# EAGLE design M220A (EAGLE 6.6.0)
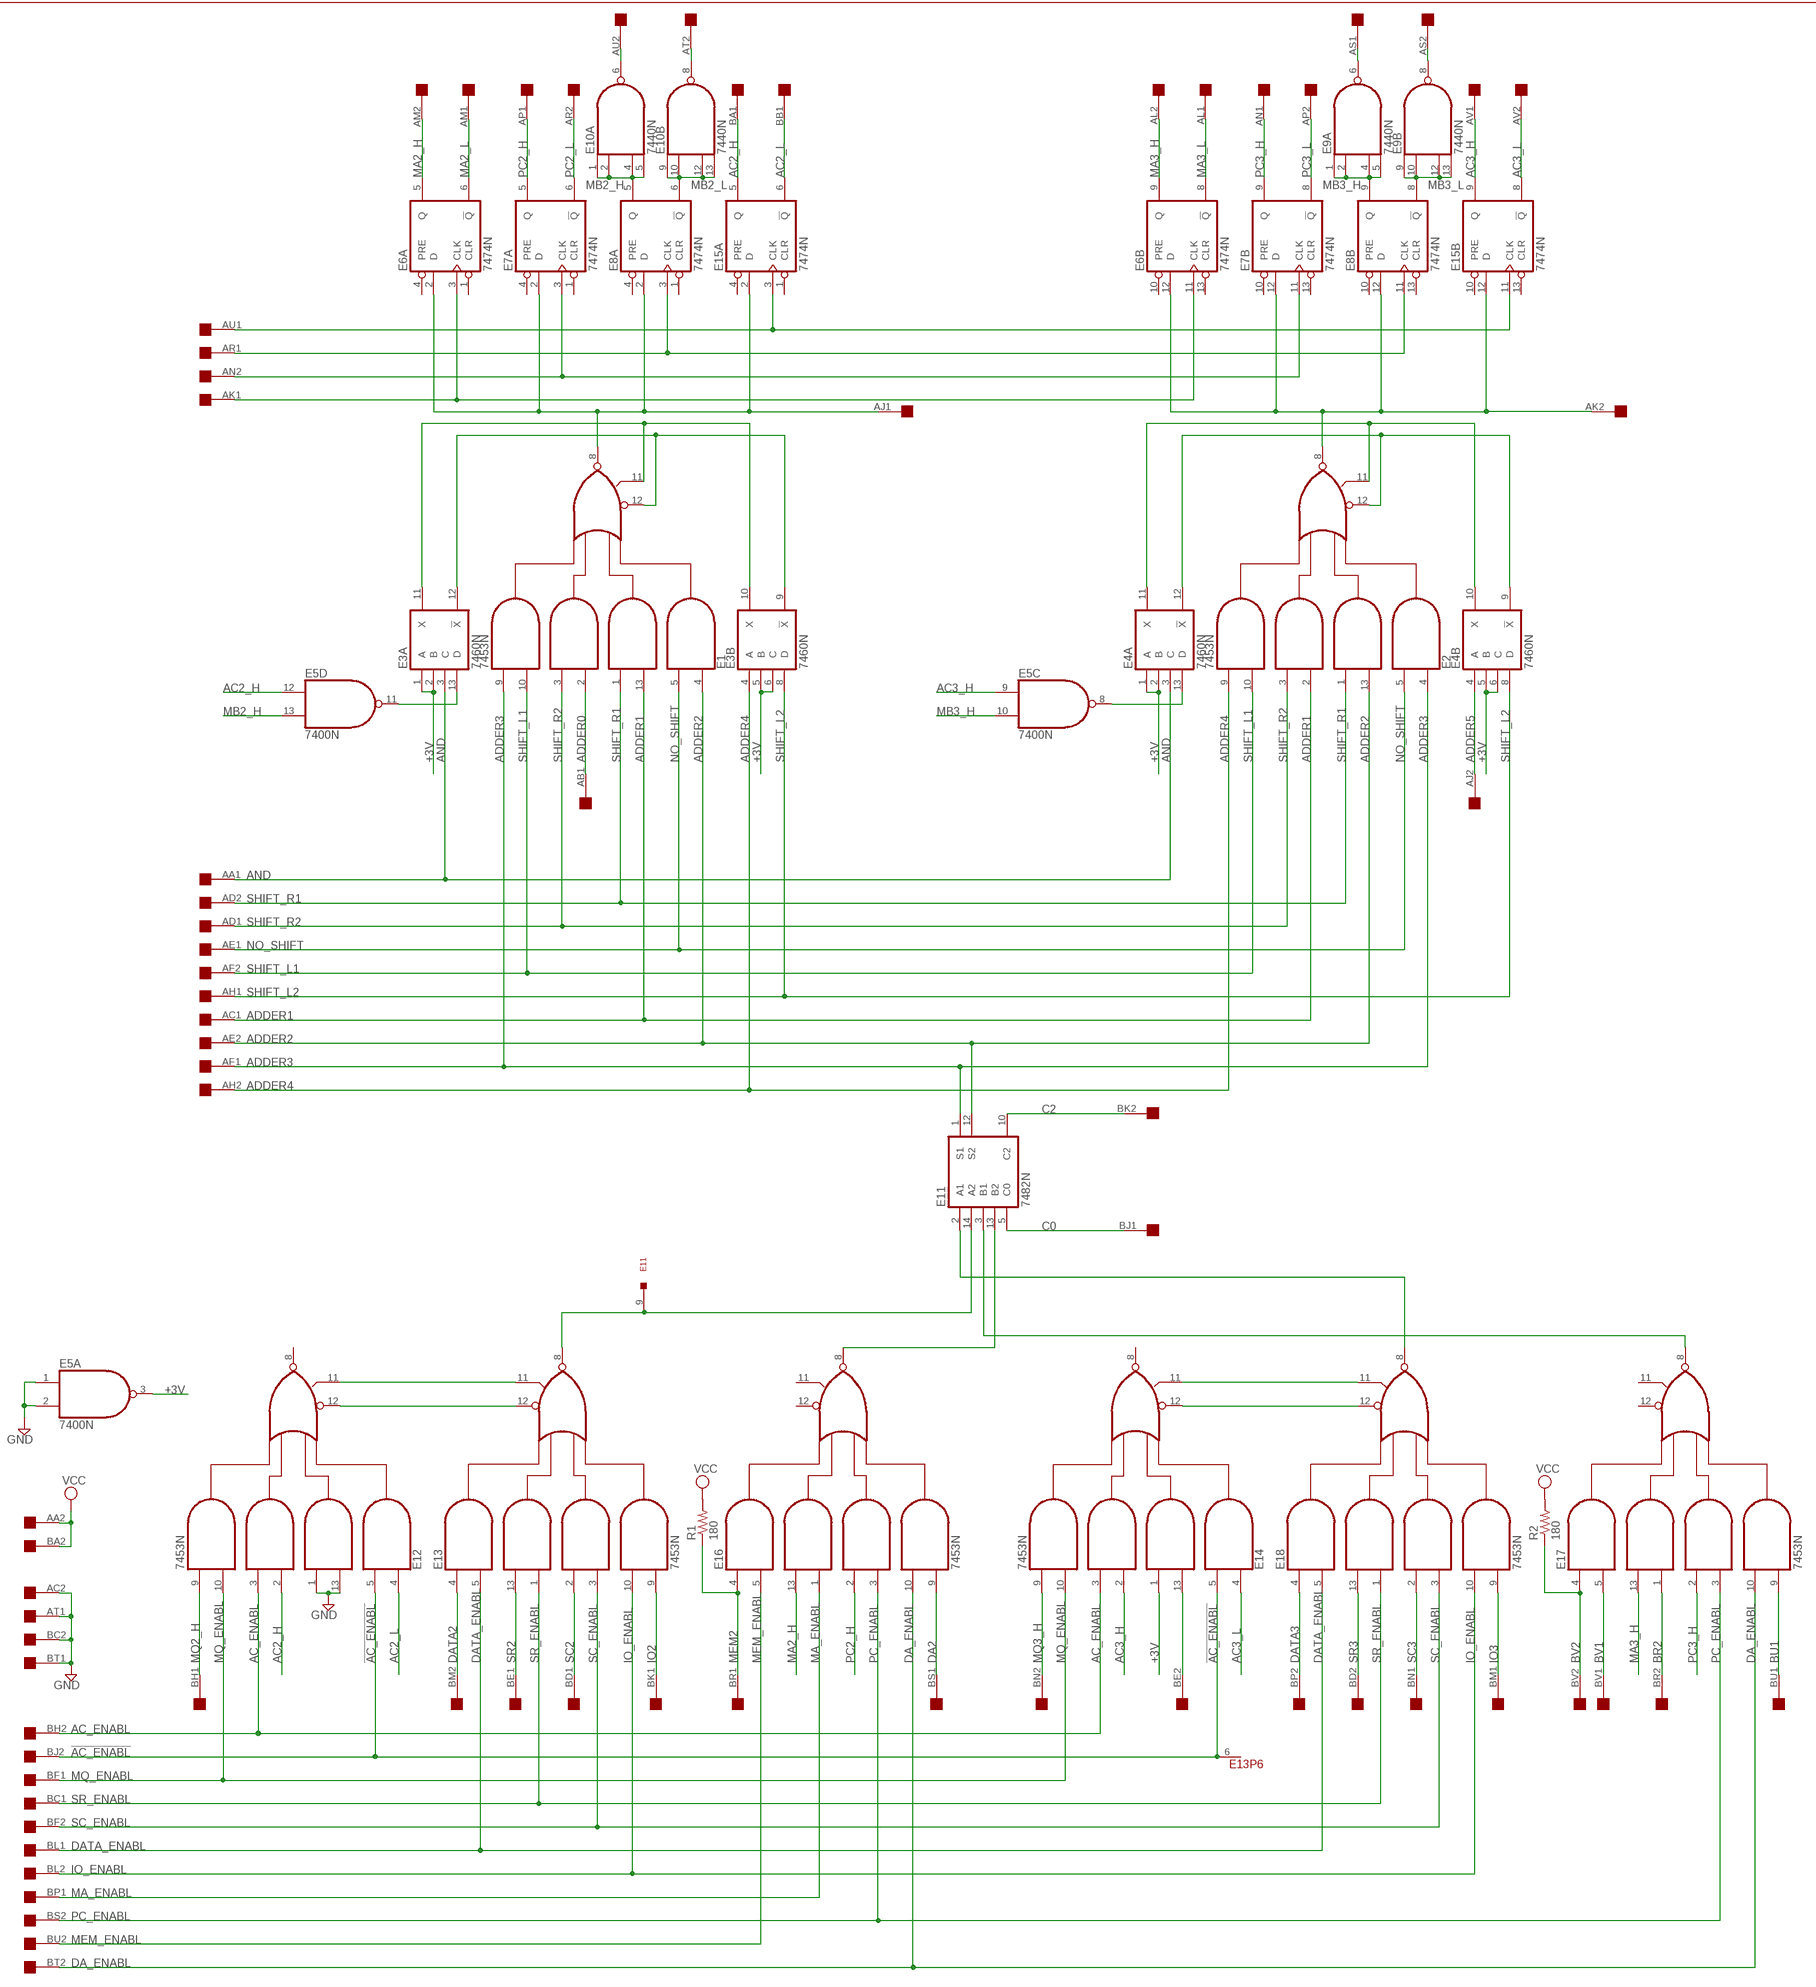
[diagram p0: schematic, sheet 1, part 1 of 2]
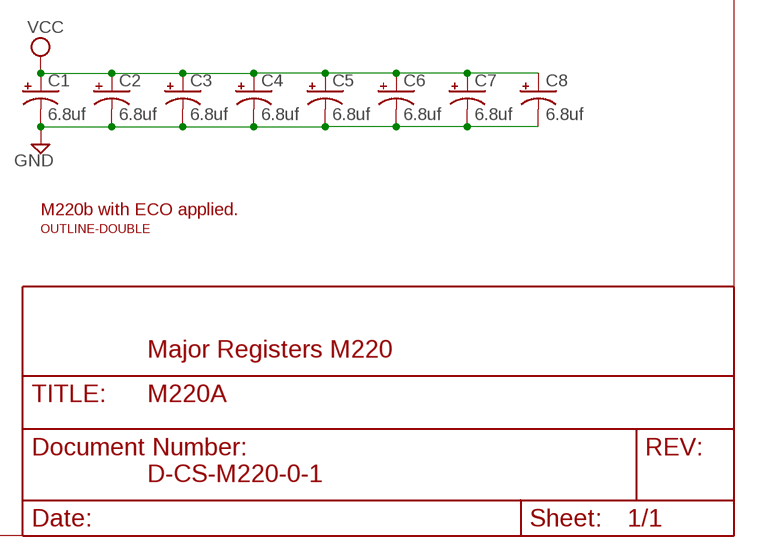
[diagram p1: schematic, sheet 1, part 2 of 2]

## Parts
C1  6.8uf  CPOL-USE15-5AXIAL  [E15-5]
C2  6.8uf  CPOL-USE15-5AXIAL  [E15-5]
C3  6.8uf  CPOL-USE15-5AXIAL  [E15-5]
C4  6.8uf  CPOL-USE15-5AXIAL  [E15-5]
C5  6.8uf  CPOL-USE15-5AXIAL  [E15-5]
C6  6.8uf  CPOL-USE15-5AXIAL  [E15-5]
C7  6.8uf  CPOL-USE15-5AXIAL  [E15-5]
C8  6.8uf  CPOL-USE15-5AXIAL  [E15-5]
E1  7453N  [DIL14]
E2  7453N  [DIL14]
E3  7460N  [DIL14]
E4  7460N  [DIL14]
E5  7400N  [DIL14]
E6  7474N  74S74N  [DIL14]
E7  7474N  74S74N  [DIL14]
E8  7474N  74S74N  [DIL14]
E9  7440N  74S20N  [DIL14]
E10  7440N  74S20N  [DIL14]
E11  7482N  [DIL14]
E12  7453N  [DIL14]
E13  7453N  [DIL14]
E14  7453N  [DIL14]
E15  7474N  74S74N  [DIL14]
E16  7453N  [DIL14]
E17  7453N  [DIL14]
E18  7453N  [DIL14]
R1  180  R-US_0207/10  [0207/10]
R2  180  R-US_0207/10  [0207/10]
U$1  DOUBLE  [EDGE-CON4]
U$2  OUTLINE-DOUBLE  [DOUBLE]

## Nets
!AC_ENABL: E12.5(I2) E13.6(SPARE) E14.5(I2) U$1.BJ2
+3V: E3.1(A:A) E3.2(A:B) E3.5(B:B) E3.6(B:C) E4.1(A:A) E4.2(A:B) E4.5(B:B) E4.6(B:C) E5.3(A:O) E14.1(I4)
AC2_H: E5.12(D:I0) E12.2(I5) E15.5(A:Q) U$1.BA1
AC2_L: E12.4(I1) E15.6(A:!Q) U$1.BB1
AC3_H: E5.9(C:I0) E14.2(I5) E15.9(B:Q) U$1.AV1
AC3_L: E14.4(I1) E15.8(B:!Q) U$1.AV2
AC_ENABL: E12.3(I6) E14.3(I6) U$1.BH2
ADDER0: E1.2(I5) U$1.AB1
ADDER1: E1.13(I3) E2.2(I5) U$1.AC1
ADDER2: E1.4(I1) E2.13(I3) E11.12(S2) U$1.AE2
ADDER3: E1.9(I8) E2.4(I1) E11.1(S1) U$1.AF1
ADDER4: E2.9(I8) E3.4(B:A) U$1.AH2
ADDER5: E4.4(B:A) U$1.AJ2
AJ1: E1.8(O) E6.2(A:D) E7.2(A:D) E8.2(A:D) E15.2(A:D) U$1.AJ1
AK1: E6.3(A:CLK) E6.11(B:CLK) U$1.AK1
AK2: E2.8(O) E6.12(B:D) E7.12(B:D) E8.12(B:D) E15.12(B:D) U$1.AK2
AN2: E7.3(A:CLK) E7.11(B:CLK) U$1.AN2
AND: E3.3(A:C) E4.3(A:C) U$1.AA1
AR1: E8.3(A:CLK) E8.11(B:CLK) U$1.AR1
AS2: E9.8(B:O) U$1.AS2
AT2: E10.8(B:O) U$1.AT2
AU1: E15.3(A:CLK) E15.11(B:CLK) U$1.AU1
AU2: E10.6(A:O) U$1.AU2
BE2: E14.13(I3) U$1.BE2
BR2: E17.1(I4) U$1.BR2
BU1: E17.9(I8) U$1.BU1
BV1: E17.5(I2) U$1.BV1
BV2: E17.4(I1) R2.1 U$1.BV2
C0: E11.5(C0) U$1.BJ1
C2: E11.10(C2) U$1.BK2
DA2: E16.9(I8) U$1.BS1
DA_ENABL: E16.10(I7) E17.10(I7) U$1.BT2
DATA2: E13.4(I1) U$1.BM2
DATA3: E18.4(I1) U$1.BP2
DATA_ENABL: E13.5(I2) E18.5(I2) U$1.BL1
GND [Supply]: C1.- C2.- C3.- C4.- C5.- C6.- C7.- C8.- E5.1(A:I0) E5.2(A:I1) E12.1(I4) E12.13(I3) U$1.AC2 U$1.AT1 U$1.BC2 U$1.BT1
IO2: E13.9(I8) U$1.BK1
IO3: E18.9(I8) U$1.BM1
IO_ENABL: E13.10(I7) E18.10(I7) U$1.BL2
MA2_H: E6.5(A:Q) E16.13(I3) U$1.AM2
MA2_L: E6.6(A:!Q) U$1.AM1
MA3_H: E6.9(B:Q) E17.13(I3) U$1.AL2
MA3_L: E6.8(B:!Q) U$1.AL1
MA_ENABL: E16.1(I4) U$1.BP1
MB2_H: E5.13(D:I1) E8.5(A:Q) E10.1(A:I0) E10.2(A:I1) E10.4(A:I2) E10.5(A:I3)
MB2_L: E8.6(A:!Q) E10.9(B:I0) E10.10(B:I1) E10.12(B:I2) E10.13(B:I3)
MB3_H: E5.10(C:I1) E8.9(B:Q) E9.1(A:I0) E9.2(A:I1) E9.4(A:I2) E9.5(A:I3)
MB3_L: E8.8(B:!Q) E9.9(B:I0) E9.10(B:I1) E9.12(B:I2) E9.13(B:I3)
MEM2: E16.4(I1) R1.1 U$1.BR1
MEM_ENABL: E16.5(I2) U$1.BU2
MQ2_H: E12.9(I8) U$1.BH1
MQ3_H: E14.9(I8) U$1.BN2
MQ_ENABL: E12.10(I7) E14.10(I7) U$1.BF1
N$1: E3.13(A:D) E5.11(D:O)
N$2: E14.12(I9) E18.12(I9)
N$3: E4.13(A:D) E5.8(C:O)
N$4: E14.11(I10) E18.11(I10)
N$5: E11.9 E11.14(A2) E13.8(O)
N$6: E12.11(I10) E13.11(I10)
N$7: E12.12(I9) E13.12(I9)
N$8: E11.2(A1) E18.8(O)
N$9: E2.12(I9) E4.9(B:!X) E4.12(A:!X)
N$10: E1.12(I9) E3.9(B:!X) E3.12(A:!X)
N$11: E2.11(I10) E4.10(B:X) E4.11(A:X)
N$12: E11.13(B2) E16.8(O)
N$13: E1.11(I10) E3.10(B:X) E3.11(A:X)
N$14: E11.3(B1) E17.8(O)
N$15: E9.6(A:O) U$1.AS1
NO_SHIFT: E1.5(I2) E2.5(I2) U$1.AE1
PC2_H: E7.5(A:Q) E16.2(I5) U$1.AP1
PC2_L: E7.6(A:!Q) U$1.AR2
PC3_H: E7.9(B:Q) E17.2(I5) U$1.AN1
PC3_L: E7.8(B:!Q) U$1.AP2
PC_ENABL: E16.3(I6) E17.3(I6) U$1.BS2
SC2: E13.2(I5) U$1.BD1
SC3: E18.2(I5) U$1.BN1
SC_ENABL: E13.3(I6) E18.3(I6) U$1.BF2
SHIFT_L1: E1.10(I7) E2.10(I7) U$1.AF2
SHIFT_L2: E3.8(B:D) E4.8(B:D) U$1.AH1
SHIFT_R1: E1.1(I4) E2.1(I4) U$1.AD2
SHIFT_R2: E1.3(I6) E2.3(I6) U$1.AD1
SR2: E13.13(I3) U$1.BE1
SR3: E18.13(I3) U$1.BD2
SR_ENABL: E13.1(I4) E18.1(I4) U$1.BC1
VCC [Supply]: C1.+ C2.+ C3.+ C4.+ C5.+ C6.+ C7.+ C8.+ R1.2 R2.2 U$1.AA2 U$1.BA2
Unconnected: E1.6(SPARE) E2.6(SPARE) E5.4(B:I0) E5.5(B:I1) E5.6(B:O) E6.1(A:CLR) E6.4(A:PRE) E6.10(B:PRE) E6.13(B:CLR) E7.1(A:CLR) E7.4(A:PRE) E7.10(B:PRE) E7.13(B:CLR) E8.1(A:CLR) E8.4(A:PRE) E8.10(B:PRE) E8.13(B:CLR) E11.6 E11.7 E11.8 E12.6(SPARE) E12.8(O) E14.6(SPARE) E14.8(O) E15.1(A:CLR) E15.4(A:PRE) E15.10(B:PRE) E15.13(B:CLR) E16.6(SPARE) E16.11(I10) E16.12(I9) E17.6(SPARE) E17.11(I10) E17.12(I9) E18.6(SPARE) U$1.AB2 U$1.BB2

## Notes on the sheet
- M220b with ECO applied.
- Major Registers M220
- D-CS-M220-0-1

## Power pins joined to a net without a drawn wire
GND: E1.7(GND) E2.7(GND) E3.7(P:GND) E4.7(P:GND) E5.7(P:GND) E6.7(P:GND) E7.7(P:GND) E8.7(P:GND) E9.7(P:GND) E10.7(P:GND) E11.11(GND) E12.7(GND) E13.7(GND) E14.7(GND) E15.7(P:GND) E16.7(GND) E17.7(GND) E18.7(GND)
VCC: E1.14(VCC) E2.14(VCC) E3.14(P:VCC) E4.14(P:VCC) E5.14(P:VCC) E6.14(P:VCC) E7.14(P:VCC) E8.14(P:VCC) E9.14(P:VCC) E10.14(P:VCC) E11.4(VCC) E12.14(VCC) E13.14(VCC) E14.14(VCC) E15.14(P:VCC) E16.14(VCC) E17.14(VCC) E18.14(VCC)

## Library data of the parts
C1-C8 = dec-con:CPOL-USE15-5AXIAL: 0.5" veresion of an electrolytic
E1 E2 E12-E14 E16-E18 = dec-con:74*53: 4-2-3-2 input AND OR INVERTER gates
E3 E4 = 74xx-us:74*60: Dual 4-input EXPANDER
E5 = 74xx-us:74*00: Quad 2-input NAND gate
E6-E8 E15 = 74xx-us:74*74: Dual D type positive edge triggered FLIP FLOP, preset and clear
E9 E10 = 74xx-us:74*20: Dual 4-input NAND gate
E11 = dec-con:74*82: 2-bit binary full ADDER Has the wrong GND pin in other libraries.
R1 R2 = rcl:R-US_: RESISTOR, American symbol
U$1 = dec-con:DOUBLE: Double-Height DEC board
U$2 = dec-con:OUTLINE-*: Board outlines for DEC boards.

## Net classes
1 Supply: width 0.813 mm

## Board
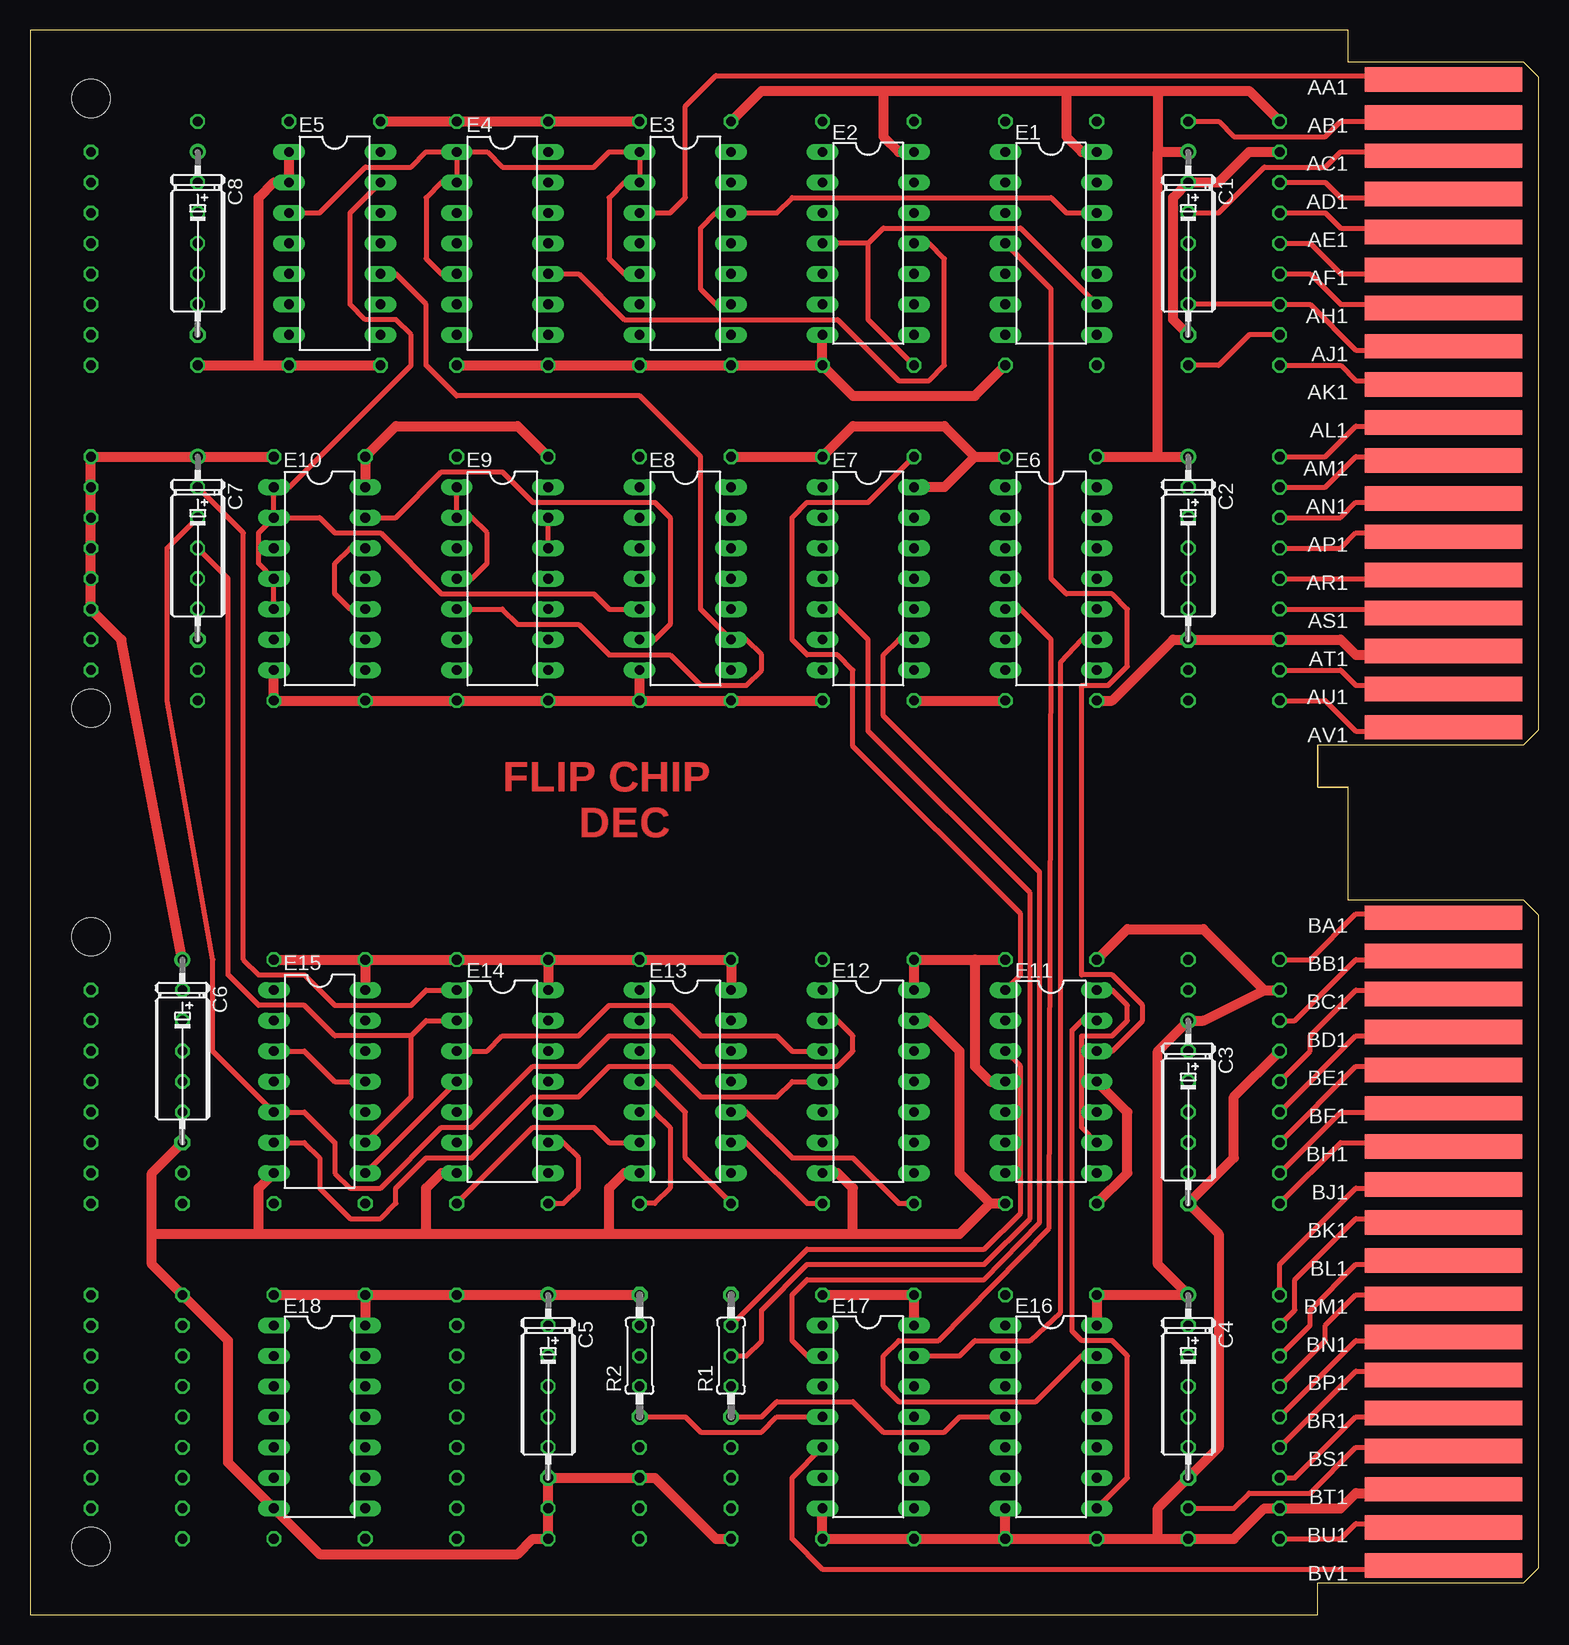
[diagram p2: board, top side]
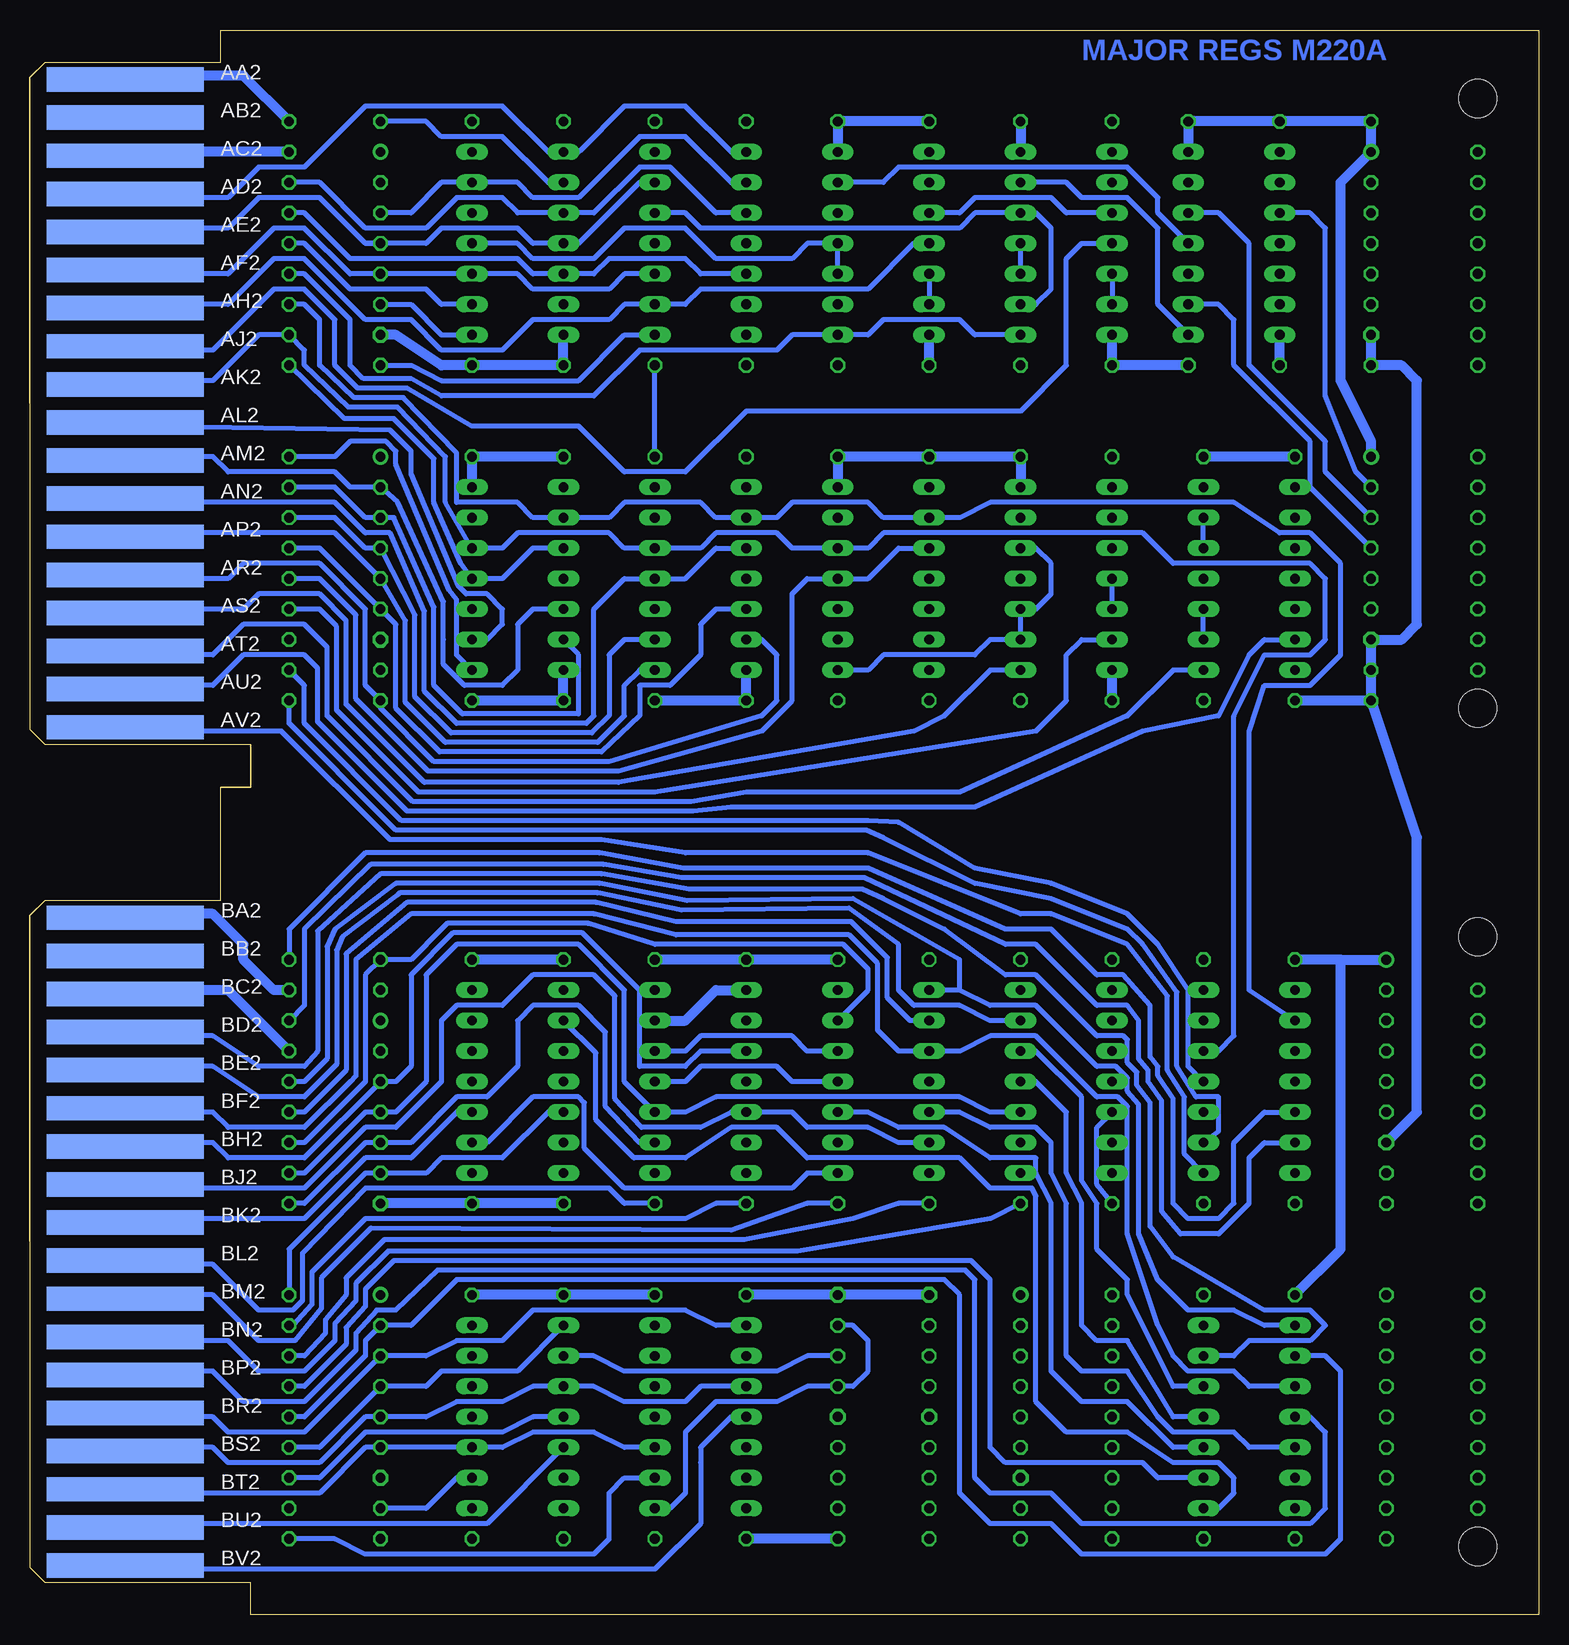
[diagram p3: board, bottom side, seen from below]

Size 125.73 x 132.08 mm. Coordinates in mm from the lower left corner, seen from the top.
Copper layers (1+16): Top 0.035mm / dielectric 1.5mm / Bottom 0.035mm
Design rules "16mils": minimum track width 16mil, minimum drill 32mil, track to track 15mil, track to pad 10mil, pad to pad 10mil, via to via 10mil, smd to smd 10mil, copper to edge 13mil, drill to drill 10mil, minimum pad ring 10mil, minimum via ring 8mil, stop-mask expansion 0mil, vias tented up to drill 0mil, thermal gap 10mil

### Footprints (pad centres in the part's own frame; a part is rotated, then mirrored left to right if it is on the bottom)
E15-5 = drill 0.813: + -7.62,0 | drill 0.813 octagon: - 7.62,0
DIL14 = drill 0.813 long: 1 -7.62,-3.81; 2 -5.08,-3.81; 3 -2.54,-3.81; 4 0,-3.81; 5 2.54,-3.81; 6 5.08,-3.81; 7 7.62,-3.81; 8 7.62,3.81; 9 5.08,3.81; 10 2.54,3.81; 11 0,3.81; 12 -2.54,3.81; 13 -5.08,3.81; 14 -7.62,3.81
0207/10 = drill 0.813 octagon: 1 -5.08,0; 2 5.08,0
EDGE-CON4 = smd 13.106 x 2.032: AA1 7.938,4.128; AB1 7.938,7.303; AC1 7.938,10.477; AD1 7.938,13.652; AE1 7.938,16.828; AF1 7.938,20.003; AH1 7.938,23.177; AJ1 7.938,26.352; AK1 7.938,29.527; AL1 7.938,32.703; AM1 7.938,35.877; AN1 7.938,39.053; AP1 7.938,42.227; AR1 7.938,45.403; AS1 7.938,48.578; AT1 7.938,51.752; AU1 7.938,54.928; AV1 7.938,58.102; BA1 7.938,73.978; BB1 7.938,77.153; BC1 7.938,80.328; BD1 7.938,83.502; BE1 7.938,86.677; BF1 7.938,89.853; BH1 7.938,93.028; BJ1 7.938,96.203; BK1 7.938,99.377; BL1 7.938,102.552; BM1 7.938,105.728; BN1 7.938,108.903; BP1 7.938,112.078; BR1 7.938,115.252; BS1 7.938,118.427; BT1 7.938,121.603; BU1 7.938,124.778; BV1 7.938,127.953 | smd 13.106 x 2.032 bottom: AA2 7.938,4.128; AB2 7.938,7.303; AC2 7.938,10.477; AD2 7.938,13.652; AE2 7.938,16.828; AF2 7.938,20.003; AH2 7.938,23.177; AJ2 7.938,26.352; AK2 7.938,29.527; AL2 7.938,32.703; AM2 7.938,35.877; AN2 7.938,39.053; AP2 7.938,42.227; AR2 7.938,45.403; AS2 7.938,48.578; AT2 7.938,51.752; AU2 7.938,54.928; AV2 7.938,58.102; BA2 7.938,73.978; BB2 7.938,77.153; BC2 7.938,80.328; BD2 7.938,83.502; BE2 7.938,86.677; BF2 7.938,89.853; BH2 7.938,93.028; BJ2 7.938,96.203; BK2 7.938,99.377; BL2 7.938,102.552; BM2 7.938,105.728; BN2 7.938,108.903; BP2 7.938,112.078; BR2 7.938,115.252; BS2 7.938,118.427; BT2 7.938,121.603; BU2 7.938,124.778; BV2 7.938,127.953
DOUBLE = hole 3.175: 120.65,56.515; 120.65,5.715; 120.65,75.565; 120.65,126.365

### Placement (x,y rotation side)
C1  96.52,114.3 270 top
C2  96.52,88.9 270 top
C3  96.52,41.91 270 top
C4  96.52,19.05 270 top
C5  43.18,19.05 270 top
C6  12.7,46.99 270 top
C7  13.97,88.9 270 top
C8  13.97,114.3 270 top
E1  85.09,114.3 270 top
E2  69.85,114.3 270 top
E3  54.61,114.3 270 top
E4  39.37,114.3 270 top
E5  25.4,114.3 270 top
E6  85.09,86.36 270 top
E7  69.85,86.36 270 top
E8  54.61,86.36 270 top
E9  39.37,86.36 270 top
E10  24.13,86.36 270 top
E11  85.09,44.45 270 top
E12  69.85,44.45 270 top
E13  54.61,44.45 270 top
E14  39.37,44.45 270 top
E15  24.13,44.45 270 top
E16  85.09,16.51 270 top
E17  69.85,16.51 270 top
E18  24.13,16.51 270 top
R1  58.42,21.59 90 top
R2  50.8,21.59 90 top
U$1  125.73,132.08 180 top
U$2  125.73,132.08 180 top
U$3  [FLIPCHIP]  20.32,73.66 270 top

### Tracks (layer width: path | path; a pad name or v marks a point on that pad's centre or on a via)
!AC_ENABL  (via drill 0.81)
  Top 0.406: E13.6 48.26,39.37 46.99,40.64 41.91,40.64 v35.56,34.29
  Bottom 0.406: U$1.BJ2 115.9,35.89 115.57,35.56 102.87,35.56 97.79,40.64 95.25,40.64 91.44,44.45 91.44,49.53 90.17,50.8 86.36,50.8 83.82,53.34 78.74,53.34 76.99,51.59 76.99,43.02 74.77,40.64 69.85,40.64 67.31,41.91 E12.5 62.23,41.91 60.96,40.64 55.88,40.64 53.34,39.37 E13.6 | E14.5 36.83,40.64 36.83,35.88 v35.56,34.29
+3V  (via drill 0.81)
  Top 0.406: E14.1 33.02,52.07 31.75,50.8 25.4,50.8 22.86,53.34 19.05,53.34 17.78,54.61 17.78,90.17 v13.97,93.98 | E4.1 E4.2 34.29,119.38 33.02,118.11 33.02,113.03 34.29,111.76 E4.5 | E4.1 38.1,121.92 39.37,120.65 46.99,120.65 48.26,121.92 E3.1 E3.2 49.53,119.38 48.26,118.11 48.26,113.03 49.53,111.76 E3.5 | E4.1 33.02,121.92 31.75,120.65 27.94,120.65 24.13,116.84 E5.3
  Bottom 0.406: E4.5 E4.6 | E3.5 E3.6 | E5.3 19.05,116.84 17.78,115.57 17.78,101.6 15.24,95.25 v13.97,93.98
AC2_H  (via drill 0.81)
  Top 0.406: U$1.BA1 117.24,58.02 116.84,58.42 110.49,58.42 106.68,54.61 v104.14,54.61 | E12.2 67.31,49.53 68.58,48.26 68.58,46.99 67.31,45.72 55.88,45.72 53.34,48.26 48.26,48.26 45.72,45.72 41.91,45.72 36.83,40.64 34.29,40.64 29.21,35.56 26.67,35.56 25.4,36.83 25.4,39.37 22.86,41.91 E15.5 15.24,46.99 15.24,54.61 11.43,76.2 11.43,88.9 v13.97,91.44
  Bottom 0.406: E15.5 22.86,41.91 25.4,39.37 25.4,34.29 26.67,33.02 29.21,33.02 30.48,34.29 30.48,43.02 31.75,44.93 31.75,45.72 32.38,46.51 32.38,50.8 34.61,53.34 36.83,53.34 40.64,57.15 44.45,57.15 55.88,62.23 71.28,62.23 78.26,63.5 97.79,63.5 104.14,57.15 v104.14,54.61 | E5.12 26.67,116.84 24.13,114.3 24.13,104.14 17.78,97.79 17.78,95.25 v13.97,91.44
AC2_L  (via drill 0.81)
  Top 0.406: U$1.BB1 117.15,54.92 116.84,54.61 110.49,54.61 105.41,49.53 v104.14,49.53 | E12.4 63.5,44.45 62.23,43.18 55.88,43.18 53.34,45.72 48.26,45.72 45.72,43.18 41.91,43.18 36.83,38.1 33.02,38.1 30.48,35.56 30.48,34.29 29.21,33.02 26.67,33.02 24.13,35.56 24.13,38.1 22.86,39.37 E15.6
  Bottom 0.406: E15.6 22.86,39.37 24.13,38.1 24.13,34.29 26.67,31.75 29.84,31.75 31.43,33.66 31.43,42.86 32.54,44.45 32.54,45.4 33.34,46.35 33.34,49.53 34.29,50.8 36.83,50.8 41.91,55.88 44.45,55.88 56.2,61.44 71.44,61.44 77.95,62.55 97.31,62.55 102.87,57.15 102.87,50.8 v104.14,49.53
AC3_H  (via drill 0.81)
  Top 0.406: 31.75,48.26 31.75,43.18 E15.9 | E14.2 33.02,49.53 31.75,48.26 | 31.75,48.26 25.4,48.26 22.86,50.8 19.05,50.8 16.51,53.34 16.51,86.36 v13.97,88.9 | U$1.AV1 115.96,74.05 115.57,73.66 110.49,73.66 107.95,76.2 v104.14,76.2
  Bottom 0.406: E15.9 26.67,40.32 26.67,43.18 28.57,43.18 30.16,45.72 30.16,51.91 33.02,55.88 34.29,57.15 40.64,59.69 46.99,60.96 54.61,64.77 56.04,65.41 95.25,65.41 96.04,66.2 | v104.14,76.2 104.14,74.3 96.04,66.2 | 96.04,66.2 | E5.9 26.67,109.22 25.4,107.95 25.4,104.14 19.05,97.79 19.05,93.98 v13.97,88.9
AC3_L
  Top 0.406: E15.8 E14.4
  Bottom 0.406: E15.8 29.53,38.42 29.53,43.18 30.96,45.4 30.96,51.59 34.29,55.88 40.64,58.42 43.18,58.42 49.53,60.96 55.88,63.5 71.12,63.5 78.11,64.61 95.73,64.61 104.78,73.66 116.84,73.66 117.23,74.05 U$1.AV2
AC_ENABL  (via drill 0.81)
  Top 0.406: E12.3 63.5,46.99 62.23,48.26 55.88,48.26 53.34,50.8 48.26,50.8 45.72,48.26 39.37,48.26 38.1,46.99 E14.3
  Bottom 0.406: U$1.BH2 117.17,39.04 116.84,39.37 110.49,39.37 109.22,38.1 102.87,38.1 v96.52,44.45 95.25,44.45 93.98,45.72 93.98,53.34 90.49,56.83 79.69,56.83 74.93,52.07 74.93,45.72 71.12,45.72 69.85,46.99 E12.3
ADDER0  (via drill 0.81)
  Top 0.406: U$1.AB1 117.15,124.77 116.84,124.46 109.22,124.46 107.95,123.19 100.33,123.19 99.06,124.46 v96.52,124.46
  Bottom 0.406: E1.2 82.55,119.38 86.36,123.19 91.44,123.19 92.71,124.46 v96.52,124.46
ADDER1  (via drill 0.81)
  Top 0.406: U$1.AC1 117.15,121.61 116.84,121.92 109.22,121.92 107.95,120.65 102.87,120.65 99.06,116.84 v96.52,116.84
  Bottom 0.406: E2.2 67.31,119.38 71.12,123.19 74.93,123.19 80.01,118.11 83.82,118.11 85.09,119.38 E1.13 91.44,119.38 93.98,116.84 v96.52,116.84
ADDER2  (via drill 0.81)
  Top 0.406: E11.12 90.17,46.99 92.71,49.53 92.71,50.8 90.17,53.34 87.63,53.34 87.63,77.47 89.85,77.47 91.44,79.06 91.44,83.82 90.17,85.09 86.36,85.09 85.09,86.36 85.09,110.49 E1.4
  Bottom 0.406: U$1.AE2 117.17,115.24 116.84,115.57 109.22,115.57 106.68,118.11 101.6,118.11 97.79,114.3 | 97.79,114.3 v96.52,114.3 | 97.79,114.3 92.71,114.3 91.44,115.57 85.09,115.57 83.82,114.3 E1.4 80.01,114.3 74.93,119.38 E2.13
ADDER3  (via drill 0.81)
  Top 0.406: U$1.AF1 117.12,112.04 116.84,111.76 109.22,111.76 106.68,114.3 v104.14,114.3 | E1.9 82.55,115.57 71.12,115.57 69.85,114.3 | 69.85,114.3 E2.4 | E11.1 82.55,53.34 82.55,58.42 68.58,72.39 68.58,78.74 67.31,80.01 64.77,80.01 63.5,81.28 63.5,91.44 64.77,92.71 69.85,92.71 v73.66,96.52 | v73.66,104.14 69.85,107.95 69.85,114.3
  Bottom 0.406: E1.9 91.44,109.22 92.71,110.49 99.06,110.49 102.87,114.3 v104.14,114.3 | v73.66,96.52 v73.66,104.14
ADDER4
  Bottom 0.406: U$1.AH2 117.17,108.89 116.84,109.22 109.22,109.22 105.41,113.03 102.87,113.03 97.79,107.95 93.98,107.95 91.44,105.41 86.36,105.41 83.82,107.95 77.47,107.95 76.2,109.22 E2.9 71.12,109.22 69.85,110.49 55.88,110.49 52.07,114.3 E3.4
ADDER5
  Bottom 0.406: U$1.AJ2 117.17,105.74 116.84,105.41 110.49,105.41 105.41,110.49 102.87,110.49 100.33,107.95 100.33,104.14 98.42,102.23 94.3,102.23 88.9,99.06 80.01,99.06 76.2,95.25 71.12,95.25 66.04,100.33 43.18,100.33 39.37,104.14 39.37,113.03 38.1,114.3 E4.4
AJ1  (via drill 0.81)
  Top 0.406: U$1.AJ1 117.17,105.74 116.84,105.41 110.49,105.41 106.68,109.22 v104.14,109.22 v96.52,109.22
  Bottom 0.406: v104.14,109.22 102.87,109.22 101.6,107.95 101.6,104.14 98.74,101.44 94.61,101.44 90.17,96.84 90.17,92.71 85.09,92.71 83.82,91.44 E6.2 77.47,91.44 76.2,92.71 69.85,92.71 68.58,91.44 E7.2 63.5,91.44 62.23,92.71 55.88,92.71 54.61,91.44 E8.2 48.26,91.44 45.72,92.71 25.4,92.71 21.59,90.17 19.05,90.17 16.51,87.63 16.51,80.01 19.05,77.47 22.86,77.47 24.13,73.66 24.13,52.07 E15.2 | E1.8 91.44,106.68 93.98,109.22 v96.52,109.22
AK1  (via drill 0.81)
  Top 0.406: U$1.AK1 117.14,102.56 116.84,102.87 110.49,102.87 109.22,104.14 v104.14,104.14
  Bottom 0.406: E6.3 83.82,88.9 86.36,86.36 E6.11 89.85,87.63 92.08,92.71 92.08,96.36 95.41,99.69 99.54,99.69 v104.14,104.14
AK2  (via drill 0.81)
  Top 0.406: v104.14,106.68 101.6,106.68 99.06,104.14 v96.52,104.14
  Bottom 0.406: U$1.AK2 117.14,102.56 116.84,102.87 110.49,102.87 106.68,106.68 v104.14,106.68 102.87,105.41 102.87,104.14 99.22,100.65 95.09,100.65 91.12,96.52 91.12,92.71 E6.12 86.36,88.9 85.09,90.17 77.47,90.17 76.2,88.9 E7.12 69.85,88.9 68.58,90.17 63.5,90.17 62.23,88.9 E8.12 55.88,88.9 54.61,90.17 33.02,90.17 30.48,87.63 19.05,87.63 17.78,86.36 17.78,81.28 19.05,80.01 22.86,80.01 25.4,74.93 25.4,48.26 26.67,46.99 E15.12 | E2.8 76.2,106.68 80.01,102.87 91.44,102.87 93.98,104.14 v96.52,104.14
AN2
  Bottom 0.406: E7.3 68.58,88.9 71.12,86.36 E7.11 76.2,86.36 78.74,83.82 78.74,74.93 79.38,74.3 90.17,74.3 92.87,76.99 92.87,83.66 95.73,90.17 97.79,90.17 100.33,92.71 116.84,92.71 117.17,93.04 U$1.AN2
AND
  Top 0.406: U$1.AA1 117.24,127.87 116.84,128.27 57.15,128.27 54.61,125.73 54.61,118.11 53.34,116.84 E3.3
  Bottom 0.406: E4.3 39.37,116.84 40.64,118.11 46.99,118.11 48.26,116.84 E3.3
AR1  (via drill 0.81)
  Top 0.406: U$1.AR1 117.17,86.69 116.84,86.36 v104.14,86.36
  Bottom 0.406: E8.3 53.34,88.9 55.88,86.36 E8.11 60.96,86.36 62.23,85.09 62.23,76.2 64.77,73.66 | v104.14,86.36 101.6,86.36 98.58,83.34 98.58,76.36 92.55,70.33 76.68,70.33 64.77,73.66 | 64.77,73.66
AS2
  Bottom 0.406: U$1.AS2 117.14,83.52 116.84,83.82 107.95,83.82 106.68,85.09 101.6,85.09 99.38,82.87 99.38,75.88 92.87,69.37 76.68,69.37 52.07,73.66 49.53,74.93 45.72,78.74 E9.8
AT2
  Bottom 0.406: U$1.AT2 117.17,80.34 116.84,80.01 110.49,80.01 107.95,82.55 102.87,82.55 100.97,80.64 100.97,74.93 93.82,67.79 70.64,67.79 66.04,68.58 48.26,68.58 34.29,74.93 30.48,78.74 E10.8
AU1  (via drill 0.81)
  Top 0.406: E15.11 25.4,44.45 22.86,46.99 E15.3 | U$1.AU1 117.17,77.14 116.84,77.47 110.49,77.47 109.22,78.74 v104.14,78.74
  Bottom 0.406: E15.11 29.21,45.72 29.21,52.07 31.75,55.88 34.29,58.42 40.64,60.96 46.99,62.23 53.34,66.04 55.88,66.2 94.77,66.2 102.87,74.3 102.87,77.47 v104.14,78.74
AU2
  Bottom 0.406: U$1.AU2 117.2,77.11 116.84,77.47 110.49,77.47 107.95,80.01 102.87,80.01 101.76,78.9 101.76,74.45 94.3,66.99 70.48,66.99 67.31,67.31 46.99,67.31 33.02,73.66 26.67,74.93 24.13,80.01 22.86,81.28 E10.6
BE2
  Bottom 0.406: U$1.BE2 117.17,45.39 116.84,45.72 110.49,45.72 106.68,43.18 102.87,43.18 100.33,45.72 100.17,45.88 100.17,55.4 99.69,56.52 95.09,60.01 94.93,60.17 78.42,60.17 71.44,58.74 57.47,58.9 53.34,55.88 53.34,52.07 52.07,50.8 48.26,50.8 45.72,49.53 E14.13
BR2  (via drill 0.81)
  Bottom 0.406: U$1.BR2 117.17,16.84 116.84,16.51 110.49,16.51 109.22,15.24 102.87,15.24 v96.52,21.59 92.71,21.59 90.17,22.86 86.36,22.86 83.82,25.4 71.12,25.4 68.58,24.13 E17.1
BU1  (via drill 0.81)
  Top 0.406: U$1.BU1 117.17,7.29 116.84,7.62 110.49,7.62 109.22,6.35 v104.14,6.35
  Bottom 0.406: E17.9 76.2,11.43 77.47,10.16 77.47,6.35 78.74,5.08 97.79,5.08 100.33,6.35 v104.14,6.35
BV1
  Top 0.406: U$1.BV1 117.23,4.2 116.84,3.81 66.04,3.81 63.5,6.35 63.5,11.43 E17.5
BV2
  Top 0.406: R2.1 54.61,16.51 55.88,15.24 60.96,15.24 62.23,16.51 E17.4
  Bottom 0.406: U$1.BV2 115.96,4.2 115.57,3.81 73.66,3.81 69.85,7.62 69.85,12.7 69.85,13.97 67.31,16.51 E17.4
C0  (via drill 0.81)
  Top 0.406: U$1.BJ1 117.17,35.89 116.84,35.56 110.49,35.56 104.14,29.21 v104.14,26.67
  Bottom 0.406: v104.14,26.67 104.14,30.48 97.79,36.83 v96.52,36.83 92.71,36.83 91.44,38.1 86.36,38.1 82.55,41.91 E11.5
C2
  Bottom 0.406: U$1.BK2 117.14,32.72 116.84,33.02 102.87,33.02 97.79,38.1 93.98,38.1 90.17,41.91 E11.10
DA2  (via drill 0.81)
  Top 0.406: U$1.BS1 117.14,13.66 116.84,13.97 110.49,13.97 106.68,10.16 101.6,10.16 100.33,8.89 v96.52,8.89
  Bottom 0.406: v96.52,8.89 92.71,8.89 90.17,11.43 E16.9
DA_ENABL  (via drill 0.81)
  Bottom 0.406: E17.10 76.2,13.97 78.74,15.24 83.82,15.24 86.36,13.97 E16.10 v96.52,13.97 97.79,13.97 101.6,10.16 116.84,10.16 117.17,10.49 U$1.BT2
DATA2  (via drill 0.81)
  Top 0.406: E13.4 52.07,44.45 54.61,41.91 54.61,38.1 v58.42,34.29
  Bottom 0.406: U$1.BM2 117.17,26.34 116.84,26.67 110.49,26.67 106.68,22.86 103.66,22.86 101.44,25.56 101.44,28.1 97.31,32.23 67.31,32.07 60.96,34.29 v58.42,34.29
DATA3
  Bottom 0.406: U$1.BP2 115.9,19.99 115.57,20.32 110.49,20.32 107.95,17.78 102.87,17.78 98.58,22.07 98.58,23.5 96.84,25.4 95.25,25.4 91.76,28.73 47.78,28.73 46.99,27.94 46.99,11.43 45.72,10.16 40.64,10.16 38.1,7.62 19.05,7.62 17.78,8.89 17.78,15.24 19.05,16.51 E18.4
DATA_ENABL  (via drill 0.81)
  Top 0.406: U$1.BL1 115.9,29.54 115.57,29.21 110.49,29.21 106.68,25.4 106.68,24.13 v104.14,21.59 | v50.8,34.29 52.07,34.29 53.34,35.56 53.34,40.64 52.07,41.91 E13.5
  Bottom 0.406: E13.5 48.26,41.91 45.72,40.64 41.91,40.64 40.64,39.37 40.64,36.83 39.37,34.29 39.37,21.59 38.1,20.32 34.29,20.32 31.75,16.51 30.48,15.24 25.4,15.24 24.13,13.97 E18.5 | v104.14,21.59 102.87,21.59 101.12,23.5 101.12,24.61 99.38,26.67 99.38,28.1 96.2,31.27 66.2,31.27 57.15,33.02 53.34,34.29 v50.8,34.29
GND  (via drill 0.81)
  Top 0.813: U$1.BT1 117.17,10.49 116.84,10.16 110.49,10.16 109.22,8.89 v104.14,8.89 102.87,8.89 100.33,6.35 v96.52,6.35 93.98,6.35 | 93.98,6.35 v88.9,6.35 v81.28,6.35 | v81.28,6.35 v73.66,6.35 v66.04,6.35 E17.7 | v81.28,6.35 E16.7 | 93.98,6.35 93.98,8.89 C4.- 99.06,13.97 99.06,31.75 C3.- 100.33,38.1 100.33,43.18 v104.14,46.99 | v58.42,6.35 57.15,6.35 52.07,11.43 v50.8,11.43 C5.- v43.18,8.89 v43.18,6.35 41.91,6.35 40.64,5.08 24.13,5.08 E18.7 16.51,12.7 16.51,22.86 v12.7,26.67 10.16,29.21 10.16,31.75 | 10.16,31.75 10.16,36.83 C6.- | E15.7 19.05,35.56 19.05,31.75 | 10.16,31.75 19.05,31.75 | E14.7 34.29,36.83 33.02,35.56 33.02,31.75 | 19.05,31.75 33.02,31.75 | E13.7 49.53,36.83 48.26,35.56 48.26,31.75 | 33.02,31.75 48.26,31.75 | E12.7 67.31,36.83 68.58,35.56 68.58,31.75 | 48.26,31.75 68.58,31.75 | 68.58,31.75 77.47,31.75 80.01,34.29 | 80.01,34.29 v81.28,34.29 | 80.01,34.29 77.47,36.83 77.47,46.99 74.93,49.53 E12.13 | v104.14,121.92 101.6,121.92 99.06,119.38 v96.52,119.38 95.25,118.11 95.25,107.95 C1.- | v13.97,104.14 19.05,104.14 | 19.05,104.14 v21.59,104.14 v29.21,104.14 | v35.56,104.14 v43.18,104.14 v50.8,104.14 v58.42,104.14 v66.04,104.14 | v66.04,104.14 68.58,101.6 78.74,101.6 v81.28,104.14 | v66.04,104.14 E2.7 | U$1.AT1 117.17,80.34 116.84,80.01 110.49,80.01 109.22,81.28 v104.14,81.28 C2.- 95.25,81.28 90.17,76.2 v88.9,76.2 | v73.66,76.2 v81.28,76.2 | E10.7 v20.32,76.2 v27.94,76.2 v35.56,76.2 v43.18,76.2 v50.8,76.2 | v50.8,76.2 v58.42,76.2 v66.04,76.2 | v50.8,76.2 E8.7 | v88.9,34.29 91.44,36.83 91.44,41.91 E11.11 | E5.1 E5.2 20.32,119.38 19.05,118.11 19.05,104.14
  Bottom 0.813: U$1.AC2 117.17,121.59 116.84,121.92 v104.14,121.92 | E1.7 v81.28,104.14 v88.9,104.14 91.44,104.14 95.25,106.68 C1.- | E4.7 v35.56,104.14 v29.21,104.14 | U$1.BC2 117.17,51.74 116.84,52.07 109.22,52.07 v104.14,46.99 | C8.- v13.97,104.14 11.43,104.14 10.16,102.87 10.16,82.55 11.43,81.28 C7.- v13.97,78.74 v13.97,76.2 | C6.- 10.16,41.91 10.16,64.77 v13.97,76.2 | v13.97,76.2 v20.32,76.2 | E6.7 v81.28,76.2 v88.9,76.2 | E7.7 v66.04,76.2 v73.66,76.2 | v58.42,6.35 v66.04,6.35 | v21.59,104.14 E5.7 | v50.8,104.14 E3.7 | C3.- v88.9,34.29 v81.28,34.29 | E12.1 68.58,52.07 71.12,49.53 E12.13 | v35.56,76.2 E9.7
IO2  (via drill 0.81)
  Top 0.406: U$1.BK1 117.14,32.72 116.84,33.02 110.49,33.02 105.41,27.94 105.41,25.4 v104.14,24.13 | E13.9 59.69,39.37 64.77,34.29 v66.04,34.29
  Bottom 0.406: v104.14,24.13 103.82,24.13 102.23,25.88 102.23,28.57 97.79,33.02 71.12,33.02 68.58,34.29 v66.04,34.29
IO3  (via drill 0.81)
  Top 0.406: U$1.BM1 115.9,26.34 115.57,26.67 110.49,26.67 107.95,24.13 107.95,22.86 v104.14,19.05
  Bottom 0.406: E18.9 31.75,11.43 33.02,12.7 44.45,12.7 45.72,13.97 45.72,27.94 47.31,29.53 94.14,29.53 95.41,29.53 97.79,27.15 97.79,25.72 99.38,23.97 99.38,22.54 102.87,19.05 v104.14,19.05
IO_ENABL  (via drill 0.81)
  Top 0.406: E13.10 59.69,41.91 63.5,38.1 68.58,38.1 72.39,34.29 v73.66,34.29
  Bottom 0.406: U$1.BL2 117.17,29.54 116.84,29.21 110.49,29.21 106.68,25.4 103.82,25.4 103.03,26.19 103.03,30.16 97.79,35.56 77.47,35.56 76.2,34.29 v73.66,34.29 | E13.10 55.88,41.91 53.34,40.64 49.53,40.64 45.72,38.1 41.91,38.1 41.91,36.83 40.64,34.29 40.64,20.32 38.1,17.78 34.29,17.78 30.48,13.97 E18.10
MA2_H  (via drill 0.81)
  Top 0.406: E6.5 82.55,83.82 85.09,81.28 84.93,32.23 75.72,22.86 72.39,22.86 71.12,21.59 71.12,19.05 72.39,17.78 83.82,17.78 87.63,21.59 E16.13
  Bottom 0.406: U$1.AM2 117.17,96.19 116.84,96.52 110.49,96.52 109.22,95.25 100.33,95.25 99.06,93.98 v96.52,93.98 95.09,92.71 91.28,84.45 91.28,81.28 | E6.5 83.82,83.82 85.09,82.55 85.09,78.74 86.36,77.47 89.53,77.47 91.28,79.22 91.28,81.28 | 91.28,81.28
MA2_L  (via drill 0.81)
  Top 0.406: U$1.AM1 117.17,96.19 116.84,96.52 110.49,96.52 107.95,93.98 v104.14,93.98
  Bottom 0.406: v104.14,93.98 100.33,93.98 97.79,91.44 v96.52,91.44 95.41,91.44 92.08,83.98 92.08,77.47 89.69,75.09 80.01,75.09 80.01,80.01 E6.6
MA3_H
  Top 0.406: E17.13 77.47,21.59 78.74,22.86 83.34,22.86 85.88,25.24 85.88,79.38 87.63,81.28 E6.9
  Bottom 0.406: U$1.AL2 117.17,99.39 116.84,99.06 95.73,98.74 93.98,97 93.98,95.09 90.01,85.72 89.38,85.09 | 89.38,85.09 | 89.38,85.09 87.63,85.09 86.36,83.82 86.36,82.55 87.63,81.28 E6.9
MA3_L  (via drill 0.81)
  Top 0.406: U$1.AL1 117.17,99.39 116.84,99.06 110.49,99.06 107.95,96.52 v104.14,96.52
  Bottom 0.406: E6.8 90.17,80.01 90.17,84.61 90.81,85.41 95.25,95.89 95.25,97 96.04,97.79 99.06,97.79 100.33,96.52 v104.14,96.52
MA_ENABL  (via drill 0.81)
  Top 0.406: U$1.BP1 117.17,19.99 116.84,20.32 110.49,20.32 v104.14,13.97
  Bottom 0.406: E16.1 85.09,20.32 91.44,20.32 92.71,19.05 v96.52,19.05 101.6,13.97 v104.14,13.97
MB2_H
  Top 0.406: E10.5 E10.4 19.05,87.63 19.05,90.17 E10.2 | E10.2 E10.1 21.59,93.98 31.75,104.14 31.75,106.68 30.48,107.95 27.94,107.95 26.67,109.22 26.67,116.84 E5.13 | E8.5 48.26,83.82 46.99,85.09 34.29,85.09 29.21,90.17 25.4,90.17 24.13,91.44 E10.2
MB2_L
  Top 0.406: E10.10 26.67,83.82 25.4,85.09 25.4,87.63 26.67,88.9 E10.12 | E8.6 52.07,81.28 53.34,82.55 53.34,91.44 52.07,92.71 41.91,92.71 39.37,95.25 34.29,95.25 30.48,91.44 E10.13
  Bottom 0.406: E10.9 E10.10 | E10.12 E10.13
MB3_H
  Top 0.406: E9.1 E9.2 36.83,91.44 38.1,90.17 38.1,87.63 36.83,86.36 E9.4 | E9.5 39.37,83.82 40.64,82.55 45.72,82.55 48.26,80.01 53.34,80.01 55.88,77.47 59.69,77.47 60.96,78.74 60.96,80.01 59.69,81.28 E8.9 55.88,83.82 55.88,96.52 50.8,101.6 35.56,101.6 33.02,104.14 33.02,109.22 30.48,111.76 E5.10
  Bottom 0.406: E9.5 E9.4
MB3_L
  Top 0.406: E9.12 E9.13
  Bottom 0.406: E8.8 55.88,78.74 54.61,80.01 46.99,80.01 45.72,81.28 E9.9 E9.10 41.91,83.82 40.64,85.09 40.64,87.63 41.91,88.9 E9.12
MEM2  (via drill 0.81)
  Top 0.406: U$1.BR1 115.9,16.84 115.57,16.51 110.49,16.51 105.41,11.43 v104.14,11.43 | R1.1 60.96,16.51 62.23,17.78 68.58,17.78 71.12,15.24 76.2,15.24 77.47,16.51 E16.4
  Bottom 0.406: E16.4 83.82,16.51 86.36,15.24 97.79,15.24 101.6,11.43 v104.14,11.43
MEM_ENABL
  Bottom 0.406: U$1.BU2 115.93,7.26 115.57,7.62 87.63,7.62 E16.5
MQ2_H  (via drill 0.81)
  Top 0.406: U$1.BH1 117.17,39.04 116.84,39.37 109.22,39.37 v104.14,34.29
  Bottom 0.406: v104.14,34.29 102.87,34.29 97.79,39.37 v96.52,39.37 93.98,39.37 90.17,43.18 87.63,43.18 85.09,45.72 85.09,49.53 83.82,50.8 80.01,50.8 77.79,48.58 77.79,42.39 74.93,39.37 E12.9
MQ3_H  (via drill 0.81)
  Top 0.406: v43.18,34.29 44.45,34.29 45.72,35.56 45.72,38.1 44.45,39.37 E14.9
  Bottom 0.406: U$1.BN2 117.17,23.19 116.84,22.86 109.22,22.86 106.68,20.32 102.87,20.32 100.33,22.86 100.33,24.29 98.58,26.19 98.58,27.62 95.89,30.32 61.75,30.32 45.72,33.02 v43.18,34.29
MQ_ENABL  (via drill 0.81)
  Top 0.406: U$1.BF1 117.12,42.19 116.84,41.91 109.22,41.91 v104.14,36.83
  Bottom 0.406: E14.10 45.72,41.91 48.26,43.18 68.58,43.18 71.12,41.91 E12.10 76.2,44.45 76.2,52.07 80.01,55.88 90.17,55.88 92.71,53.34 92.71,44.45 95.25,41.91 v96.52,41.91 97.79,41.91 102.87,36.83 v104.14,36.83
N$1
  Bottom 0.406: E3.13 54.61,119.38 53.34,120.65 34.29,120.65 31.75,118.11 31.75,116.84 E5.11
N$2
  Bottom 0.406: E14.12 41.91,46.99 38.1,43.18 38.1,36.2 36.83,34.29 36.83,30.48 34.29,27.94 34.29,26.67 30.48,19.05 E18.12
N$3
  Bottom 0.406: E5.8 31.75,109.22 31.75,115.57 34.29,118.11 38.1,118.11 39.37,119.38 E4.13
N$4
  Bottom 0.406: E14.11 41.91,44.45 39.37,41.91 39.37,36.83 38.1,34.29 38.1,24.13 36.83,22.86 34.29,22.86 30.48,16.51 E18.11
N$5
  Top 0.406: E11.14 90.17,52.07 91.44,50.8 91.44,49.53 90.17,48.26 87.63,48.26 87.63,40.64 E11.9
  Bottom 0.406: E13.8 60.96,36.83 62.23,35.56 76.2,35.56 79.53,38.89 79.53,42.7 80.01,43.18 83.82,43.18 87.63,39.37 E11.9
N$6
  Bottom 0.406: E13.11 62.23,44.45 63.5,45.72 69.85,45.72 71.12,44.45 E12.11
N$7
  Bottom 0.406: E13.12 60.96,46.99 62.23,48.26 69.85,48.26 71.12,46.99 E12.12
N$8
  Bottom 0.406: E18.8 26.67,8.89 25.4,10.16 25.4,11.43 26.67,12.7 30.48,12.7 34.29,15.24 39.37,15.24 41.91,17.78 41.91,34.92 42.23,35.56 45.72,35.56 48.26,38.1 60.96,38.1 63.5,40.64 67.31,40.64 71.12,38.1 75.41,38.1 76.68,39.37 | 76.68,39.37 | 76.68,39.37 78.58,41.27 78.58,46.83 E11.2
N$9
  Bottom 0.406: E2.12 71.12,116.84 69.85,115.57 48.26,115.57 46.99,116.84 E4.12 41.91,116.84 40.64,115.57 40.64,110.49 41.91,109.22 E4.9
N$10
  Top 0.406: E1.12 86.36,116.84 85.09,118.11 63.5,118.11 62.23,116.84 E3.12 57.15,116.84 55.88,115.57 55.88,110.49 57.15,109.22 E3.9
N$11
  Top 0.406: E2.11 74.93,114.3 76.2,113.03 76.2,104.14 74.93,102.87 72.39,102.87 67.31,107.95 49.53,107.95 45.72,111.76 E4.10
  Bottom 0.406: E4.10 E4.11
N$12
  Top 0.406: E16.8 91.44,11.43 91.44,21.59 90.17,22.86 87.63,22.86 | 87.63,22.86 | 87.63,22.86 86.84,23.65 86.84,48.74 87.63,49.53 E11.13
N$13
  Bottom 0.406: E1.11 85.09,114.3 83.82,113.03 78.74,113.03 76.2,115.57 71.12,115.57 68.58,113.03 62.23,113.03 60.96,114.3 E3.11 E3.10
N$14  (via drill 0.81)
  Top 0.406: v58.42,24.13 64.77,30.48 79.53,30.48 82.55,33.5 82.55,45.72 E11.3
  Bottom 0.406: E17.8 72.39,8.89 71.12,10.16 71.12,15.24 68.58,17.78 63.5,17.78 60.96,19.05 v58.42,19.05 57.15,19.05 55.88,20.32 55.88,22.86 57.15,24.13 v58.42,24.13
N$15  (via drill 0.81)
  Top 0.406: U$1.AS1 117.14,83.52 116.84,83.82 v104.14,83.82
  Bottom 0.406: v104.14,83.82 101.6,83.82 100.17,82.39 100.17,75.41 93.34,68.58 73.66,68.58 41.91,73.66 39.37,76.2 39.37,80.01 38.1,81.28 E9.6
N$16  (via drill 0.81)
  other vias: 88.9,124.46
N$17  (via drill 0.81)
  other vias: 81.28,124.46
N$18  (via drill 0.81)
  other vias: 13.97,119.38
N$19  (via drill 0.81)
  other vias: 13.97,116.84
N$20  (via drill 0.81)
  other vias: 13.97,114.3
N$21  (via drill 0.81)
  other vias: 13.97,111.76
N$22  (via drill 0.81)
  other vias: 13.97,109.22
N$51  (via drill 0.81)
  other vias: 66.04,124.46
N$52  (via drill 0.81)
  other vias: 73.66,124.46
N$56  (via drill 0.81)
  other vias: 13.97,86.36
N$57  (via drill 0.81)
  other vias: 13.97,83.82
N$62  (via drill 0.81)
  other vias: 35.56,96.52
N$71  (via drill 0.81)
  other vias: 96.52,78.74
N$96  (via drill 0.81)
  other vias: 12.7,6.35
N$97  (via drill 0.81)
  other vias: 12.7,8.89
N$98  (via drill 0.81)
  other vias: 12.7,11.43
N$99  (via drill 0.81)
  other vias: 12.7,13.97
N$100  (via drill 0.81)
  other vias: 12.7,16.51
N$101  (via drill 0.81)
  other vias: 12.7,19.05
N$102  (via drill 0.81)
  other vias: 12.7,21.59
N$103  (via drill 0.81)
  other vias: 12.7,24.13
N$105  (via drill 0.81)
  other vias: 12.7,34.29
N$106  (via drill 0.81)
  other vias: 12.7,36.83
N$107  (via drill 0.81)
  other vias: 20.32,34.29
N$108  (via drill 0.81)
  other vias: 27.94,34.29
N$128  (via drill 0.81)
  other vias: 96.52,52.07
N$142  (via drill 0.81)
  other vias: 96.52,46.99
N$146  (via drill 0.81)
  other vias: 35.56,24.13
N$147  (via drill 0.81)
  other vias: 35.56,21.59
N$148  (via drill 0.81)
  other vias: 35.56,19.05
N$149  (via drill 0.81)
  other vias: 35.56,16.51
N$150  (via drill 0.81)
  other vias: 35.56,13.97
N$151  (via drill 0.81)
  other vias: 35.56,11.43
N$152  (via drill 0.81)
  other vias: 35.56,8.89
N$153  (via drill 0.81)
  other vias: 35.56,6.35
N$154  (via drill 0.81)
  other vias: 27.94,6.35
N$155  (via drill 0.81)
  other vias: 20.32,6.35
N$158  (via drill 0.81)
  other vias: 43.18,13.97
N$159  (via drill 0.81)
  other vias: 43.18,16.51
N$160  (via drill 0.81)
  other vias: 43.18,19.05
N$161  (via drill 0.81)
  other vias: 43.18,21.59
N$162  (via drill 0.81)
  other vias: 43.18,24.13
N$163  (via drill 0.81)
  other vias: 50.8,24.13
N$164  (via drill 0.81)
  other vias: 50.8,21.59
N$165  (via drill 0.81)
  other vias: 50.8,19.05
N$169  (via drill 0.81)
  other vias: 50.8,6.35
N$170  (via drill 0.81)
  other vias: 50.8,8.89
N$172  (via drill 0.81)
  other vias: 50.8,13.97
N$173  (via drill 0.81)
  other vias: 58.42,13.97
N$174  (via drill 0.81)
  other vias: 58.42,11.43
N$175  (via drill 0.81)
  other vias: 58.42,8.89
N$200  (via drill 0.81)
  other vias: 5.08,8.89
N$201  (via drill 0.81)
  other vias: 5.08,11.43
N$202  (via drill 0.81)
  other vias: 5.08,13.97
N$203  (via drill 0.81)
  other vias: 5.08,16.51
N$204  (via drill 0.81)
  other vias: 5.08,19.05
N$205  (via drill 0.81)
  other vias: 5.08,21.59
N$206  (via drill 0.81)
  other vias: 5.08,24.13
N$207  (via drill 0.81)
  other vias: 5.08,26.67
N$208  (via drill 0.81)
  other vias: 5.08,34.29
N$209  (via drill 0.81)
  other vias: 5.08,36.83
N$210  (via drill 0.81)
  other vias: 5.08,39.37
N$211  (via drill 0.81)
  other vias: 5.08,52.07
N$212  (via drill 0.81)
  other vias: 5.08,49.53
N$213  (via drill 0.81)
  other vias: 12.7,52.07
N$214  (via drill 0.81)
  other vias: 12.7,49.53
N$215  (via drill 0.81)
  other vias: 12.7,46.99
N$216  (via drill 0.81)
  other vias: 12.7,44.45
N$217  (via drill 0.81)
  other vias: 12.7,41.91
N$218  (via drill 0.81)
  other vias: 5.08,46.99
N$219  (via drill 0.81)
  other vias: 5.08,44.45
N$220  (via drill 0.81)
  other vias: 5.08,41.91
N$221  (via drill 0.81)
  other vias: 5.08,78.74
N$222  (via drill 0.81)
  other vias: 5.08,81.28
N$226  (via drill 0.81)
  other vias: 5.08,121.92
N$227  (via drill 0.81)
  other vias: 5.08,119.38
N$228  (via drill 0.81)
  other vias: 5.08,116.84
N$229  (via drill 0.81)
  other vias: 5.08,114.3
N$230  (via drill 0.81)
  other vias: 5.08,111.76
N$231  (via drill 0.81)
  other vias: 5.08,109.22
N$232  (via drill 0.81)
  other vias: 5.08,106.68
N$233  (via drill 0.81)
  other vias: 5.08,104.14
NO_SHIFT  (via drill 0.81)
  Top 0.406: U$1.AE1 117.17,115.24 116.84,115.57 109.22,115.57 107.95,116.84 v104.14,116.84
  Bottom 0.406: v104.14,116.84 102.87,116.84 99.06,113.03 85.09,113.03 83.82,111.76 E1.5 78.74,111.76 77.47,113.03 71.12,113.03 69.85,111.76 E2.5
PC2_H  (via drill 0.81)
  Top 0.406: U$1.AP1 115.9,89.84 115.57,90.17 110.49,90.17 109.22,88.9 v104.14,88.9 | v58.42,21.59 59.69,21.59 60.96,22.86 60.96,25.4 64.77,29.21 79.53,29.21 83.34,33.02 83.34,60.17 69.85,73.66 69.85,81.28 67.31,83.82 E7.5
  Bottom 0.406: E16.2 78.74,21.59 76.2,20.32 63.5,20.32 60.96,21.59 v58.42,21.59 | v104.14,88.9 101.6,88.9 v96.52,83.82 95.25,82.55 95.25,75.56 91.6,71.91 78.11,71.91 74.93,74.93 74.93,77.47 72.39,77.47 69.85,80.01 69.85,82.55 68.58,83.82 E7.5
PC2_L  (via drill 0.81)
  Bottom 0.406: U$1.AR2 117.17,86.69 116.84,86.36 109.22,86.36 107.95,87.63 101.6,87.63 97.79,83.82 97.79,77.47 v96.52,76.2 96.52,75.56 92.08,71.12 77.47,71.12 64.77,74.93 63.5,76.2 63.5,80.01 64.77,81.28 E7.6
PC3_H  (via drill 0.81)
  Top 0.406: U$1.AN1 115.9,93.04 115.57,92.71 110.49,92.71 109.22,91.44 v104.14,91.44 | E17.2 64.77,21.59 63.5,22.86 63.5,26.67 64.77,27.94 79.53,27.94 84.14,32.7 84.14,61.91 71.12,74.93 71.12,80.01 72.39,81.28 E7.9
  Bottom 0.406: v104.14,91.44 100.33,91.44 97.79,88.9 v96.52,88.9 93.66,83.34 93.66,76.52 90.65,73.5 78.9,73.5 77.47,74.93 77.47,80.01 76.2,81.28 E7.9
PC3_L  (via drill 0.81)
  Bottom 0.406: U$1.AP2 117.17,89.84 116.84,90.17 100.33,90.17 v96.52,86.36 94.46,82.87 94.46,76.04 91.12,72.71 78.42,72.71 76.2,74.93 76.2,77.47 74.93,78.74 E7.8
PC_ENABL  (via drill 0.81)
  Bottom 0.406: E17.3 69.85,19.05 71.12,17.78 76.2,17.78 78.74,19.05 E16.3 83.82,19.05 86.36,17.78 90.17,17.78 92.71,16.51 v96.52,16.51 97.79,16.51 101.6,12.7 109.22,12.7 110.49,13.97 116.84,13.97 117.14,13.66 U$1.BS2
SC2  (via drill 0.81)
  Top 0.406: U$1.BD1 117.14,48.56 116.84,48.26 110.49,48.26 v104.14,41.91
  Bottom 0.406: v104.14,41.91 102.87,41.91 99.54,45.24 99.38,45.4 99.38,55.09 94.3,59.37 78.58,59.37 71.91,57.78 57.31,57.78 54.29,54.77 54.29,51.44 52.39,49.53 E13.2
SC3  (via drill 0.81)
  Top 0.406: U$1.BN1 115.9,23.19 115.57,22.86 110.49,22.86 105.41,17.78 v104.14,16.51
  Bottom 0.406: v104.14,16.51 102.87,16.51 97.79,21.59 97.79,22.86 v96.52,24.13 93.98,24.13 90.17,27.94 49.53,27.94 48.26,26.67 48.26,10.16 45.72,7.62 40.64,7.62 38.1,5.08 17.78,5.08 16.51,6.35 16.51,20.32 17.78,21.59 E18.2
SC_ENABL
  Bottom 0.406: U$1.BF2 117.12,42.19 116.84,41.91 110.49,41.91 109.22,40.64 102.87,40.64 99.06,44.45 98.58,44.93 98.58,54.61 93.98,58.42 78.74,58.42 71.91,56.67 57.47,56.67 55.09,54.29 55.09,48.74 53.34,46.99 E13.3 48.26,46.99 45.72,48.26 41.91,48.26 36.83,43.18 35.08,43.18 34.29,42.39 34.29,31.75 31.75,24.13 30.48,21.59 29.21,20.32 25.4,20.32 24.13,19.05 E18.3
SHIFT_L1  (via drill 0.81)
  Bottom 0.406: E2.10 76.2,111.76 77.47,110.49 83.82,110.49 85.09,111.76 E1.10 v96.52,111.76 99.06,111.76 102.87,115.57 105.41,115.57 109.22,111.76 116.84,111.76 117.12,112.04 U$1.AF2
SHIFT_L2  (via drill 0.81)
  Top 0.406: U$1.AH1 117.17,108.89 116.84,109.22 109.22,109.22 106.68,111.76 v104.14,111.76
  Bottom 0.406: v104.14,111.76 102.87,111.76 99.06,107.95 99.06,104.14 97.95,103.03 93.98,103.03 91.44,101.6 78.74,101.6 74.93,105.41 63.5,105.41 62.23,106.68 E3.8 55.88,106.68 54.61,107.95 48.26,107.95 46.99,106.68 E4.8
SHIFT_R1
  Bottom 0.406: 116.84,118.11 117.07,118.34 | 116.84,118.11 109.33,118.11 109.22,118.11 109.15,118.18 106.68,120.65 102.87,120.65 97.79,125.73 86.47,125.73 86.36,125.73 86.29,125.66 82.55,121.92 E1.1 80.11,121.92 80.01,121.92 79.94,121.99 76.2,125.73 71.12,125.73 67.31,121.92 E2.1 | U$1.AD2 117.14,118.42 116.84,118.11
SHIFT_R2  (via drill 0.81)
  Top 0.406: U$1.AD1 115.88,118.42 115.57,118.11 109.22,118.11 107.95,119.38 v104.14,119.38
  Bottom 0.406: v104.14,119.38 101.6,119.38 97.79,115.57 92.71,115.57 90.17,118.11 86.36,118.11 85.09,116.84 E1.3 78.74,116.84 74.93,120.65 72.39,120.65 68.58,116.84 E2.3
SR2  (via drill 0.81)
  Top 0.406: U$1.BE1 117.17,45.39 116.84,45.72 110.49,45.72 v104.14,39.37
  Bottom 0.406: v104.14,39.37 102.87,39.37 97.79,44.45 97.79,53.34 v96.52,54.61 93.98,54.61 91.44,57.15 | 91.44,57.15 | 91.44,57.15 90.96,57.63 79.22,57.63 73.66,55.88 57.94,55.88 55.88,53.82 55.88,52.07 E13.13
SR3
  Bottom 0.406: U$1.BD2 117.14,48.56 116.84,48.26 110.49,48.26 106.68,45.72 102.87,45.72 101.76,46.99 101.76,56.99 96.52,61.75 78.11,61.75 70.8,60.48 56.36,60.48 54.61,59.69 49.53,57.15 44.45,53.34 41.91,53.34 36.83,48.26 34.61,48.26 34.29,47.94 34.29,46.04 33.5,45.24 33.5,44.13 32.38,42.7 32.38,32.38 30.48,29.84 22.86,25.4 19.05,25.4 17.78,24.13 19.05,22.86 24.13,22.86 25.4,21.59 E18.13
SR_ENABL  (via drill 0.81)
  Top 0.406: U$1.BC1 117.15,51.76 116.84,52.07 110.49,52.07 106.68,48.26 106.68,46.99 v104.14,44.45
  Bottom 0.406: E18.1 22.86,24.13 25.4,25.4 29.21,25.4 31.75,27.94 33.34,31.75 33.34,42.55 34.29,43.66 34.29,44.77 35.24,45.72 36.83,45.72 41.91,50.8 45.72,50.8 48.26,52.07 | 48.26,52.07 E13.1 | v104.14,44.45 102.87,44.45 100.97,46.35 100.97,55.72 100.33,57.15 95.25,60.96 78.26,60.96 70.96,59.53 57.15,59.69 48.26,54.61 48.26,52.07
VCC  (via drill 0.81)
  Top 0.813: v20.32,54.61 v27.94,54.61 | v27.94,54.61 v35.56,54.61 v43.18,54.61 | v43.18,54.61 v50.8,54.61 v58.42,54.61 E13.14 | v27.94,54.61 E15.14 | v43.18,54.61 E14.14 | E12.14 v73.66,54.61 78.74,54.61 | 78.74,54.61 v81.28,54.61 | E11.4 80.01,44.45 78.74,45.72 78.74,54.61 | 102.87,52.07 97.79,49.53 C3.+ 93.98,46.99 93.98,29.21 C4.+ v88.9,26.67 E16.14 | 102.87,52.07 v104.14,52.07 | v88.9,54.61 91.44,57.15 97.79,57.15 102.87,52.07 | v104.14,124.46 101.6,127 93.98,127 | 71.12,127 60.96,127 v58.42,124.46 | 71.12,127 86.36,127 | 86.36,127 93.98,127 | E2.14 72.39,121.92 71.12,123.19 71.12,127 | E1.14 87.63,121.92 86.36,123.19 86.36,127 | 93.98,121.92 C1.+ | 93.98,127 93.98,121.92 | 93.98,96.52 C2.+ | 93.98,96.52 93.98,121.92 | v88.9,96.52 93.98,96.52 | E7.14 76.2,93.98 78.74,96.52 | 78.74,96.52 v81.28,96.52 | v58.42,96.52 v66.04,96.52 68.58,99.06 76.2,99.06 78.74,96.52 | v43.18,96.52 40.64,99.06 30.48,99.06 v27.94,96.52 E10.14 | v20.32,96.52 C7.+ v5.08,96.52 v5.08,93.98 v5.08,91.44 v5.08,88.9 v5.08,86.36 v5.08,83.82 7.62,81.28 C6.+ | v50.8,124.46 v43.18,124.46 v35.56,124.46 v29.21,124.46 | v20.32,26.67 v27.94,26.67 | v27.94,26.67 E18.14 | v27.94,26.67 v35.56,26.67 C5.+ R2.2 | v66.04,26.67 v73.66,26.67 E17.14
  Bottom 0.813: U$1.AA2 117.24,127.87 116.84,128.27 107.95,128.27 v104.14,124.46 | E9.14 v43.18,96.52 v50.8,96.52 v58.42,96.52 E8.14 | E5.14 v29.21,124.46 v21.59,124.46 v13.97,124.46 C8.+ 16.51,119.38 16.51,102.87 13.97,97.79 C7.+ | E3.14 v58.42,124.46 v50.8,124.46 | E6.14 v88.9,96.52 v81.28,96.52 | U$1.BA2 117.24,58.02 116.84,58.42 110.49,58.42 107.95,55.88 107.95,54.61 105.41,52.07 v104.14,52.07 | R2.2 R1.2 v66.04,26.67 | 16.51,54.61 C6.+ | 16.51,54.61 v20.32,54.61 | 16.51,54.61 16.51,30.48 v20.32,26.67 | v73.66,54.61 v66.04,54.61 v58.42,54.61 | v81.28,54.61 v88.9,54.61 | v20.32,96.52 v27.94,96.52 | v43.18,124.46 E4.14 | v88.9,26.67 v81.28,26.67 v73.66,26.67

### Text on the board
Top: DEC
Bottom: MAJOR REGS M220A